# Altium schematic sheet DVT-Atlas-Driver2.SchDoc: DVT Atlas Driver
size A4; PartNumber: PN0044; Drawn By: Sebastian Kulik
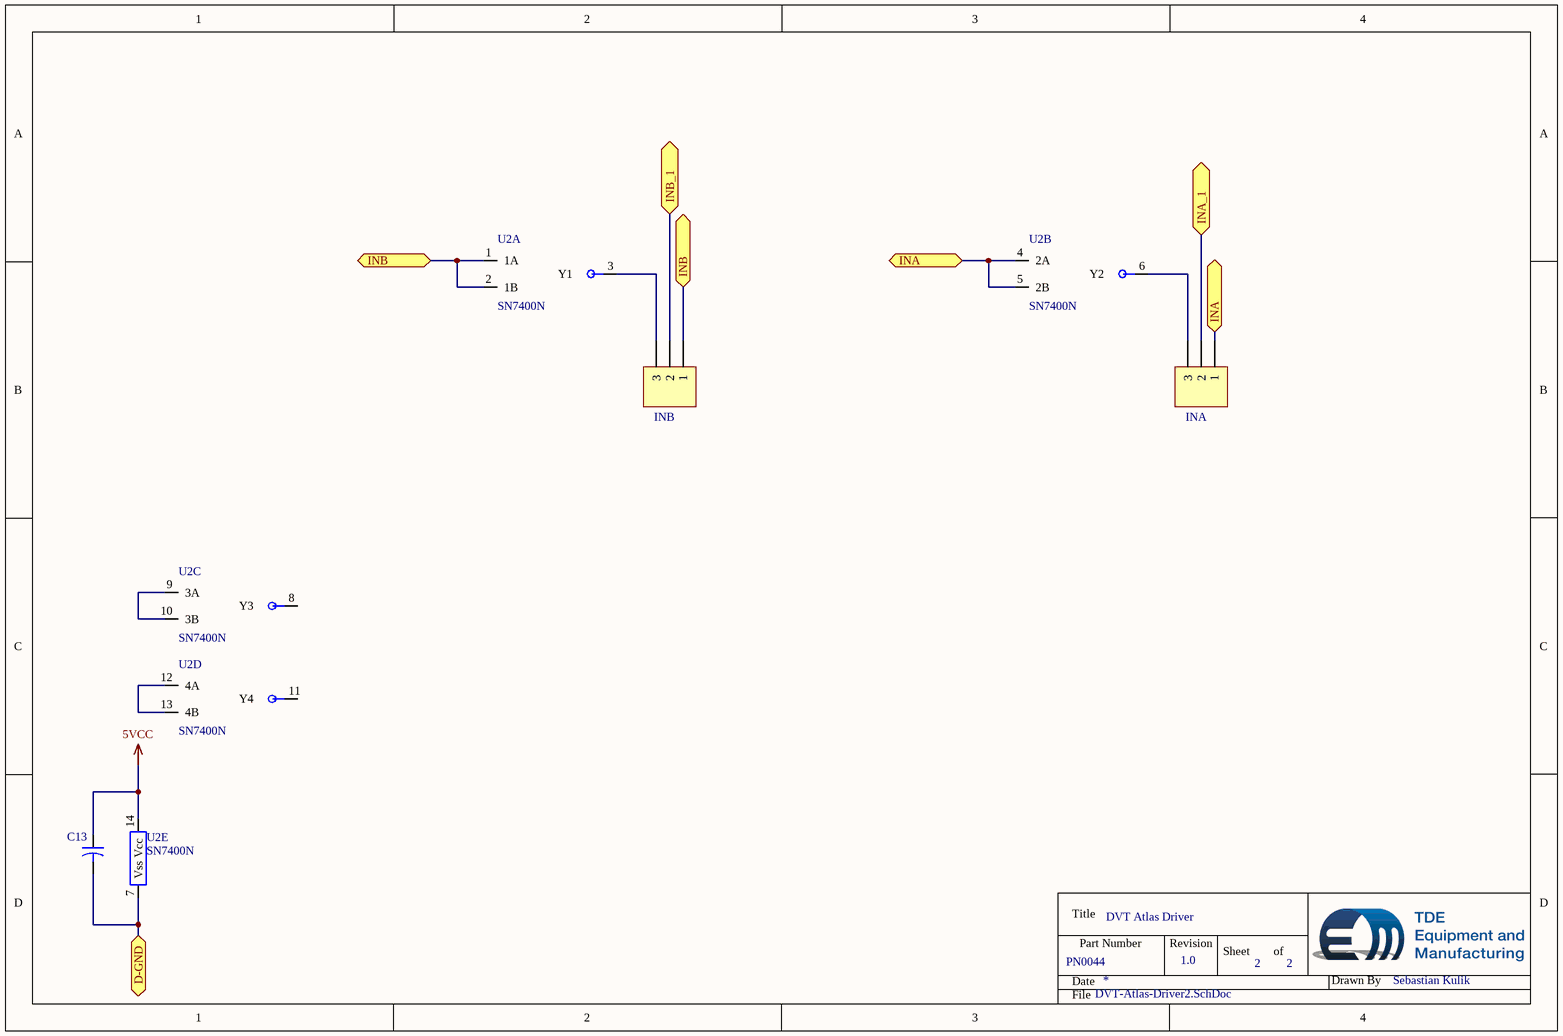
[diagram p0: DVT-Atlas-Driver2.SchDoc]

## Parts
C13  Capacitor-Dummy-THT  [KEMET-C052H]  (value not drawn)
INA  Plug_3_90_2.54  [HDR1X3]  (value not drawn)
INB  Plug_3_90_2.54  [HDR1X3]  (value not drawn)
U2  SN7400N  [DIP-14]  (parts A,B,C,D,E of 5)

## Ports
D-GND, INA, INA_1, INB, INB_1

## Nets
5VCC: C13.1 U2.14(Vcc)
D-GND: C13.2 U2.7(Vss) ; port D-GND
INA: INA.1 U2.4(2A) U2.5(2B) ; port INA
INA_1: INA.2 ; port INA_1
INB: INB.1 U2.1(1A) U2.2(1B) ; port INB
INB_1: INB.2 ; port INB_1
NetINA_3: INA.3 U2.6(Y2)
NetINB_3: INB.3 U2.3(Y1)
NetU2_9: U2.9(3A) U2.10(3B)
NetU2_12: U2.12(4A) U2.13(4B)

Not connected (* = marked no-connect by the designer): U2 8(Y3) 11(Y4)

## Notes on the sheet
- 1.0
- 2
- Title
- Date
- Part Number
- Revision
- Sheet
- of
- Drawn By
- File

## Library data of the parts
INA INB = Plug_3_90_2.54: Plug,-3-Pin; Manufacturer: WE; Manufacturer PartNr: 61300311021; Deliverer PartNr: 828-1585; Deliverer: RS; TDE-PN: CON0011; Publisher: Sebastian Kulik; Price: 0.138/5
U2 = SN7400N: Quad NAND, TTL; Deliverer PartNr: 305-490; Manufacturer: TI; Deliverer: RS; TDE-PN: IC0076; Published: 13.05.2016; PackageDescription: SOIC28; Publisher: Sebastian Kulik; Manufacturer PartNr: SN7400N; Price: 1.45
C13 = Capacitor-Dummy-THT: Published: 08.12.2015; Part Description: Capacitor-Dummy-THT; Publisher: Sebastian Kulik; PackageDescription: -; Deliverer: -; Deliverer PartNr: -; Manufacturer: -; Manufacturer PartNr: -; TDE-PN: -; Value: Value; Price: *